# Altium schematic sheet 07_FPGA_banks_1_2_3_4.SchDoc: FPGA banks 1, 2, 3, 4
size A3; Organization: Lime Microsystems; Address1: Surrey Tech Centre; Address2: Guildford GU2 7YG; Address3: Surrey; Address4: United Kingdom; Revision: v1.2; SheetNumber: 7; SheetTotal: 14
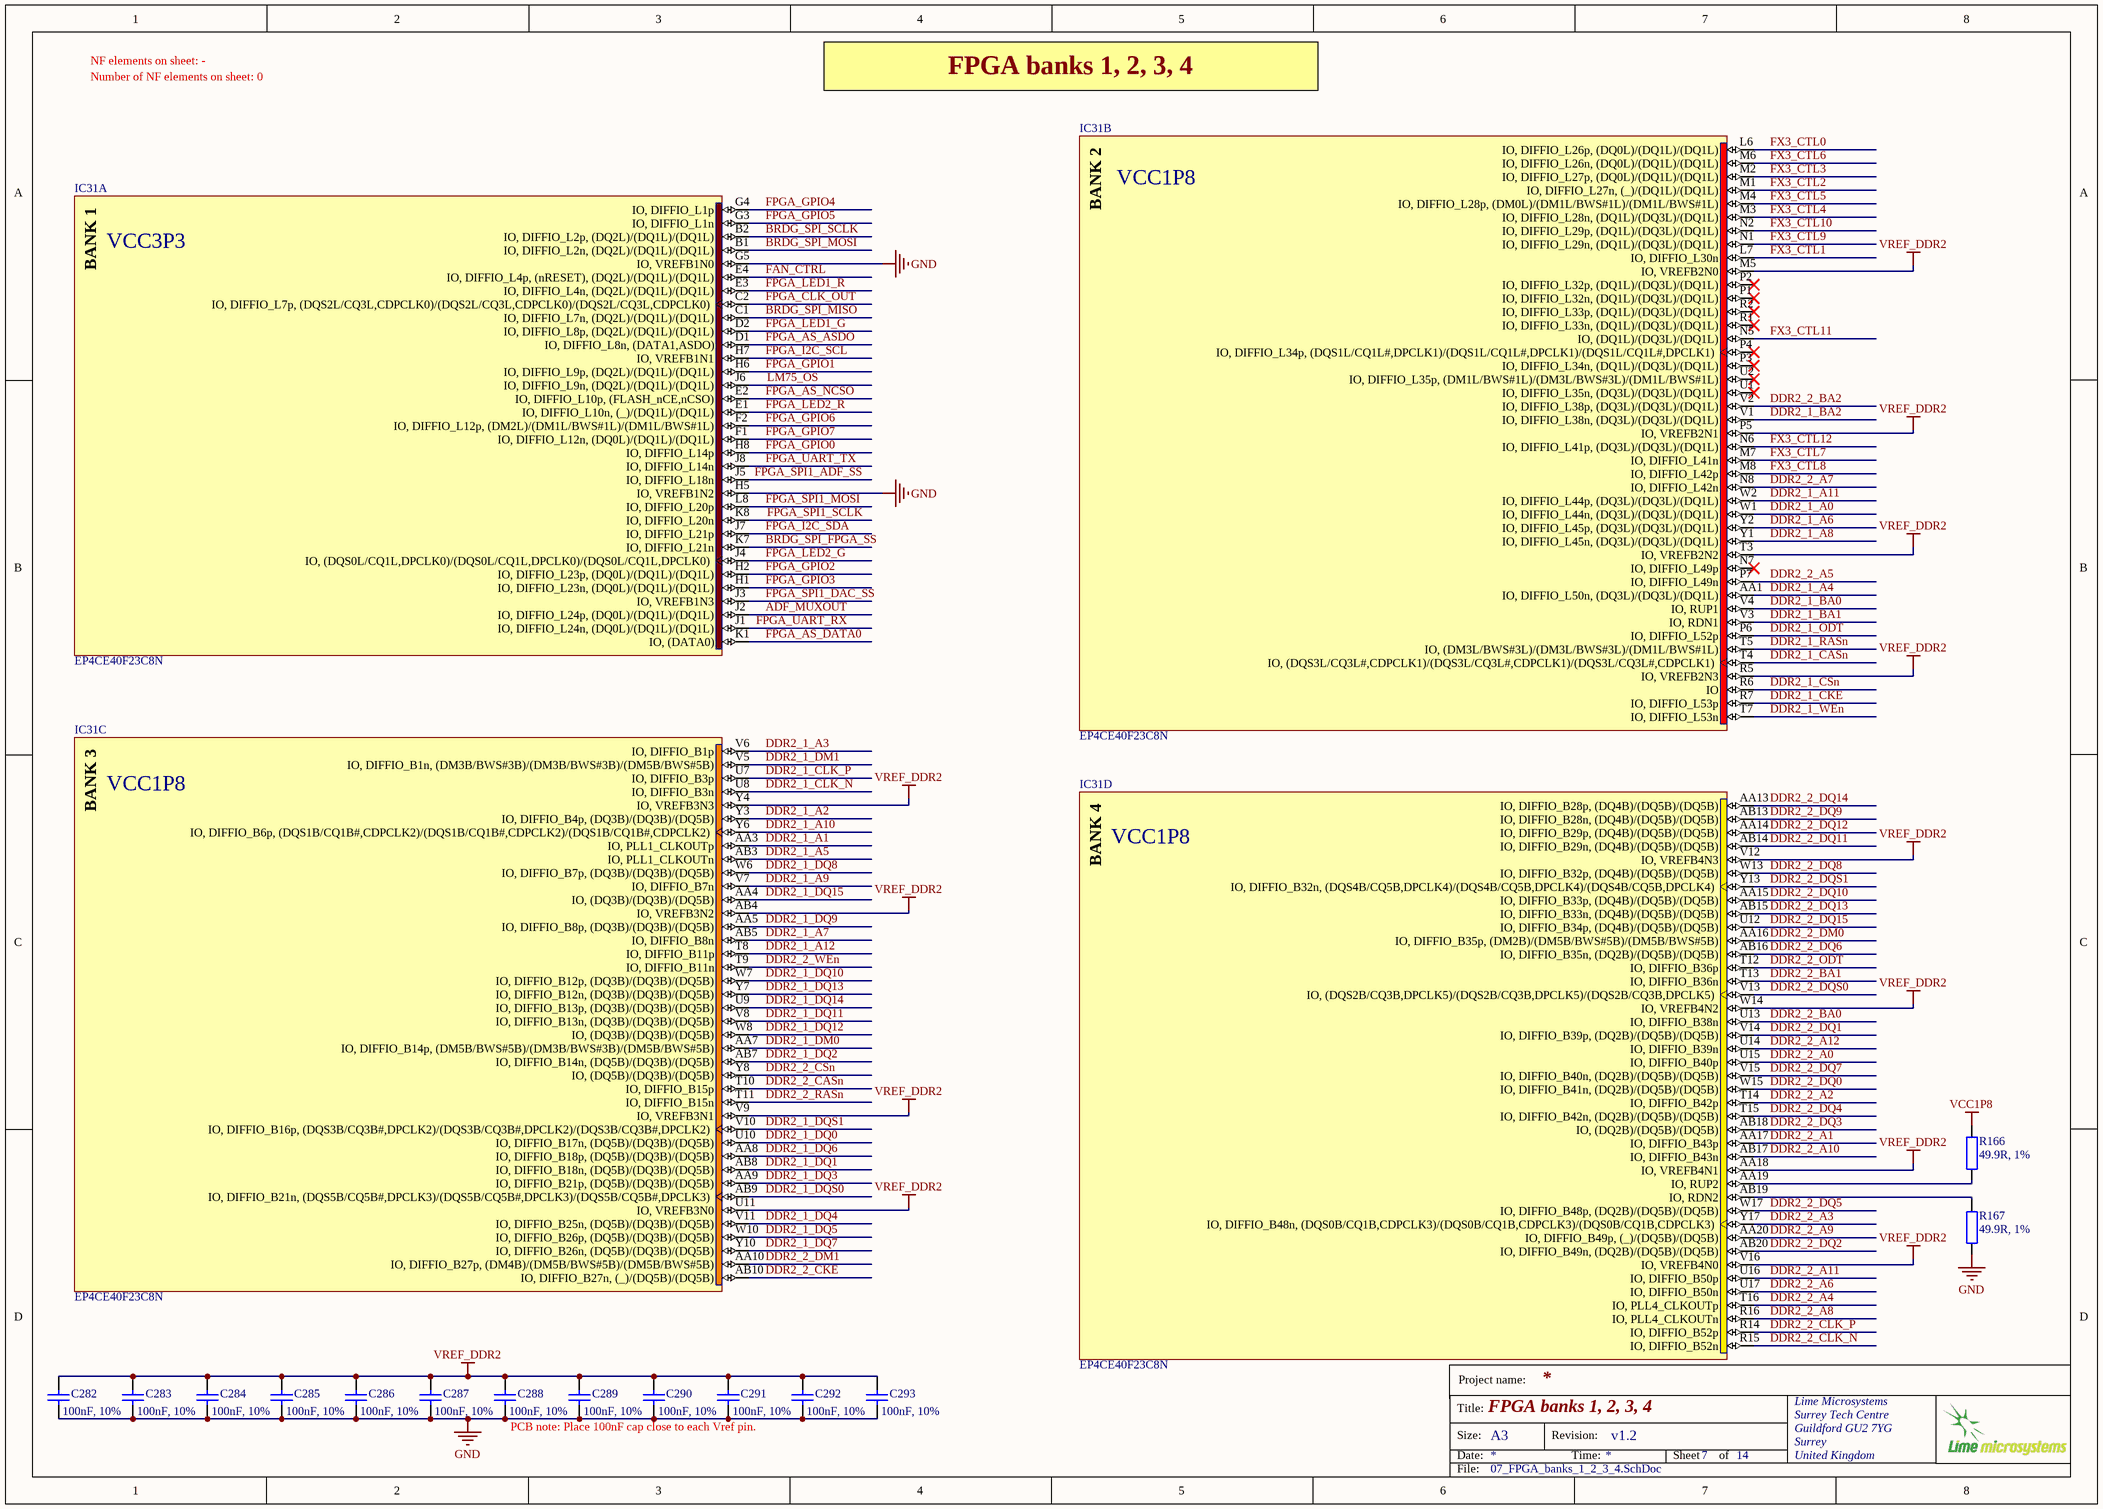
[diagram p0: 07_FPGA_banks_1_2_3_4.SchDoc]

## Parts
C282  100nF, 10%  [CAP0402]
C283  100nF, 10%  [CAP0402]
C284  100nF, 10%  [CAP0402]
C285  100nF, 10%  [CAP0402]
C286  100nF, 10%  [CAP0402]
C287  100nF, 10%  [CAP0402]
C288  100nF, 10%  [CAP0402]
C289  100nF, 10%  [CAP0402]
C290  100nF, 10%  [CAP0402]
C291  100nF, 10%  [CAP0402]
C292  100nF, 10%  [CAP0402]
C293  100nF, 10%  [CAP0402]
IC31  EP4CE40F23C8N  [FBGA484_A-240]  (parts A,B,C,D of 13)
R166  49.9R, 1%  [RES0402]
R167  49.9R, 1%  [RES0402]

## Nets
GND: C282.2 C283.2 C284.2 C285.2 C286.2 C287.2 C288.2 C289.2 C290.2 C291.2 C292.2 C293.2 IC31.G5(IO,_VREFB1N0) IC31.H5(IO,_VREFB1N2) R167.1
VCC1P8: R166.2
VREF_DDR2: C282.1 C283.1 C284.1 C285.1 C286.1 C287.1 C288.1 C289.1 C290.1 C291.1 C292.1 C293.1 IC31.AA18(IO,_VREFB4N1) IC31.AB4(IO,_VREFB3N2) IC31.M5(IO,_VREFB2N0) IC31.P5(IO,_VREFB2N1) IC31.R5(IO,_VREFB2N3) IC31.T3(IO,_VREFB2N2) IC31.U11(IO,_VREFB3N0) IC31.V9(IO,_VREFB3N1) IC31.V12(IO,_VREFB4N3) IC31.V16(IO,_VREFB4N0) IC31.W14(IO,_VREFB4N2) IC31.Y4(IO,_VREFB3N3)
ADF_MUXOUT: IC31.J2(IO,_DIFFIO_L24p,_(DQ0L)/(DQ1L)/(DQ1L))
BRDG_SPI_FPGA_SS: IC31.K7(IO,_DIFFIO_L21n)
BRDG_SPI_MISO: IC31.C1(IO,_DIFFIO_L7n,_(DQ2L)/(DQ1L)/(DQ1L))
BRDG_SPI_MOSI: IC31.B1(IO,_DIFFIO_L2n,_(DQ2L)/(DQ1L)/(DQ1L))
BRDG_SPI_SCLK: IC31.B2(IO,_DIFFIO_L2p,_(DQ2L)/(DQ1L)/(DQ1L))
DDR2_1_A0: IC31.W1(IO,_DIFFIO_L44n,_(DQ3L)/(DQ3L)/(DQ1L))
DDR2_1_A1: IC31.AA3(IO,_PLL1_CLKOUTp)
DDR2_1_A2: IC31.Y3(IO,_DIFFIO_B4p,_(DQ3B)/(DQ3B)/(DQ5B))
DDR2_1_A3: IC31.V6(IO,_DIFFIO_B1p)
DDR2_1_A4: IC31.AA1(IO,_DIFFIO_L50n,_(DQ3L)/(DQ3L)/(DQ1L))
DDR2_1_A5: IC31.AB3(IO,_PLL1_CLKOUTn)
DDR2_1_A6: IC31.Y2(IO,_DIFFIO_L45p,_(DQ3L)/(DQ3L)/(DQ1L))
DDR2_1_A7: IC31.AB5(IO,_DIFFIO_B8n)
DDR2_1_A8: IC31.Y1(IO,_DIFFIO_L45n,_(DQ3L)/(DQ3L)/(DQ1L))
DDR2_1_A9: IC31.V7(IO,_DIFFIO_B7n)
DDR2_1_A10: IC31.Y6(IO,_DIFFIO_B6p,_(DQS1B/CQ1B#,CDPCLK2)/(DQS1B/CQ1B#,CDPCLK2)/(DQS1B/CQ1B#,CDPCLK2))
DDR2_1_A11: IC31.W2(IO,_DIFFIO_L44p,_(DQ3L)/(DQ3L)/(DQ1L))
DDR2_1_A12: IC31.T8(IO,_DIFFIO_B11p)
DDR2_1_BA0: IC31.V4(IO,_RUP1)
DDR2_1_BA1: IC31.V3(IO,_RDN1)
DDR2_1_BA2: IC31.V1(IO,_DIFFIO_L38n,_(DQ3L)/(DQ3L)/(DQ1L))
DDR2_1_CASn: IC31.T4(IO,_(DQS3L/CQ3L#,CDPCLK1)/(DQS3L/CQ3L#,CDPCLK1)/(DQS3L/CQ3L#,CDPCLK1))
DDR2_1_CKE: IC31.R7(IO,_DIFFIO_L53p)
DDR2_1_CLK_N: IC31.U8(IO,_DIFFIO_B3n)
DDR2_1_CLK_P: IC31.U7(IO,_DIFFIO_B3p)
DDR2_1_CSn: IC31.R6(IO)
DDR2_1_DM0: IC31.AA7(IO,_DIFFIO_B14p,_(DM5B/BWS#5B)/(DM3B/BWS#3B)/(DM5B/BWS#5B))
DDR2_1_DM1: IC31.V5(IO,_DIFFIO_B1n,_(DM3B/BWS#3B)/(DM3B/BWS#3B)/(DM5B/BWS#5B))
DDR2_1_DQ0: IC31.U10(IO,_DIFFIO_B17n,_(DQ5B)/(DQ3B)/(DQ5B))
DDR2_1_DQ1: IC31.AB8(IO,_DIFFIO_B18n,_(DQ5B)/(DQ3B)/(DQ5B))
DDR2_1_DQ2: IC31.AB7(IO,_DIFFIO_B14n,_(DQ5B)/(DQ3B)/(DQ5B))
DDR2_1_DQ3: IC31.AA9(IO,_DIFFIO_B21p,_(DQ5B)/(DQ3B)/(DQ5B))
DDR2_1_DQ4: IC31.V11(IO,_DIFFIO_B25n,_(DQ5B)/(DQ3B)/(DQ5B))
DDR2_1_DQ5: IC31.W10(IO,_DIFFIO_B26p,_(DQ5B)/(DQ3B)/(DQ5B))
DDR2_1_DQ6: IC31.AA8(IO,_DIFFIO_B18p,_(DQ5B)/(DQ3B)/(DQ5B))
DDR2_1_DQ7: IC31.Y10(IO,_DIFFIO_B26n,_(DQ5B)/(DQ3B)/(DQ5B))
DDR2_1_DQ8: IC31.W6(IO,_DIFFIO_B7p,_(DQ3B)/(DQ3B)/(DQ5B))
DDR2_1_DQ9: IC31.AA5(IO,_DIFFIO_B8p,_(DQ3B)/(DQ3B)/(DQ5B))
DDR2_1_DQ10: IC31.W7(IO,_DIFFIO_B12p,_(DQ3B)/(DQ3B)/(DQ5B))
DDR2_1_DQ11: IC31.V8(IO,_DIFFIO_B13n,_(DQ3B)/(DQ3B)/(DQ5B))
DDR2_1_DQ12: IC31.W8(IO,_(DQ3B)/(DQ3B)/(DQ5B))
DDR2_1_DQ13: IC31.Y7(IO,_DIFFIO_B12n,_(DQ3B)/(DQ3B)/(DQ5B))
DDR2_1_DQ14: IC31.U9(IO,_DIFFIO_B13p,_(DQ3B)/(DQ3B)/(DQ5B))
DDR2_1_DQ15: IC31.AA4(IO,_(DQ3B)/(DQ3B)/(DQ5B))
DDR2_1_DQS0: IC31.AB9(IO,_DIFFIO_B21n,_(DQS5B/CQ5B#,DPCLK3)/(DQS5B/CQ5B#,DPCLK3)/(DQS5B/CQ5B#,DPCLK3))
DDR2_1_DQS1: IC31.V10(IO,_DIFFIO_B16p,_(DQS3B/CQ3B#,DPCLK2)/(DQS3B/CQ3B#,DPCLK2)/(DQS3B/CQ3B#,DPCLK2))
DDR2_1_ODT: IC31.P6(IO,_DIFFIO_L52p)
DDR2_1_RASn: IC31.T5(IO,_(DM3L/BWS#3L)/(DM3L/BWS#3L)/(DM1L/BWS#1L))
DDR2_1_WEn: IC31.T7(IO,_DIFFIO_L53n)
DDR2_2_A0: IC31.U15(IO,_DIFFIO_B40p)
DDR2_2_A1: IC31.AA17(IO,_DIFFIO_B43p)
DDR2_2_A2: IC31.T14(IO,_DIFFIO_B42p)
DDR2_2_A3: IC31.Y17(IO,_DIFFIO_B48n,_(DQS0B/CQ1B,CDPCLK3)/(DQS0B/CQ1B,CDPCLK3)/(DQS0B/CQ1B,CDPCLK3))
DDR2_2_A4: IC31.T16(IO,_PLL4_CLKOUTp)
DDR2_2_A5: IC31.P7(IO,_DIFFIO_L49n)
DDR2_2_A6: IC31.U17(IO,_DIFFIO_B50n)
DDR2_2_A7: IC31.N8(IO,_DIFFIO_L42n)
DDR2_2_A8: IC31.R16(IO,_PLL4_CLKOUTn)
DDR2_2_A9: IC31.AA20(IO,_DIFFIO_B49p,_(_)/(DQ5B)/(DQ5B))
DDR2_2_A10: IC31.AB17(IO,_DIFFIO_B43n)
DDR2_2_A11: IC31.U16(IO,_DIFFIO_B50p)
DDR2_2_A12: IC31.U14(IO,_DIFFIO_B39n)
DDR2_2_BA0: IC31.U13(IO,_DIFFIO_B38n)
DDR2_2_BA1: IC31.T13(IO,_DIFFIO_B36n)
DDR2_2_BA2: IC31.V2(IO,_DIFFIO_L38p,_(DQ3L)/(DQ3L)/(DQ1L))
DDR2_2_CASn: IC31.T10(IO,_DIFFIO_B15p)
DDR2_2_CKE: IC31.AB10(IO,_DIFFIO_B27n,_(_)/(DQ5B)/(DQ5B))
DDR2_2_CLK_N: IC31.R15(IO,_DIFFIO_B52n)
DDR2_2_CLK_P: IC31.R14(IO,_DIFFIO_B52p)
DDR2_2_CSn: IC31.Y8(IO,_(DQ5B)/(DQ3B)/(DQ5B))
DDR2_2_DM0: IC31.AA16(IO,_DIFFIO_B35p,_(DM2B)/(DM5B/BWS#5B)/(DM5B/BWS#5B))
DDR2_2_DM1: IC31.AA10(IO,_DIFFIO_B27p,_(DM4B)/(DM5B/BWS#5B)/(DM5B/BWS#5B))
DDR2_2_DQ0: IC31.W15(IO,_DIFFIO_B41n,_(DQ2B)/(DQ5B)/(DQ5B))
DDR2_2_DQ1: IC31.V14(IO,_DIFFIO_B39p,_(DQ2B)/(DQ5B)/(DQ5B))
DDR2_2_DQ2: IC31.AB20(IO,_DIFFIO_B49n,_(DQ2B)/(DQ5B)/(DQ5B))
DDR2_2_DQ3: IC31.AB18(IO,_(DQ2B)/(DQ5B)/(DQ5B))
DDR2_2_DQ4: IC31.T15(IO,_DIFFIO_B42n,_(DQ2B)/(DQ5B)/(DQ5B))
DDR2_2_DQ5: IC31.W17(IO,_DIFFIO_B48p,_(DQ2B)/(DQ5B)/(DQ5B))
DDR2_2_DQ6: IC31.AB16(IO,_DIFFIO_B35n,_(DQ2B)/(DQ5B)/(DQ5B))
DDR2_2_DQ7: IC31.V15(IO,_DIFFIO_B40n,_(DQ2B)/(DQ5B)/(DQ5B))
DDR2_2_DQ8: IC31.W13(IO,_DIFFIO_B32p,_(DQ4B)/(DQ5B)/(DQ5B))
DDR2_2_DQ9: IC31.AB13(IO,_DIFFIO_B28n,_(DQ4B)/(DQ5B)/(DQ5B))
DDR2_2_DQ10: IC31.AA15(IO,_DIFFIO_B33p,_(DQ4B)/(DQ5B)/(DQ5B))
DDR2_2_DQ11: IC31.AB14(IO,_DIFFIO_B29n,_(DQ4B)/(DQ5B)/(DQ5B))
DDR2_2_DQ12: IC31.AA14(IO,_DIFFIO_B29p,_(DQ4B)/(DQ5B)/(DQ5B))
DDR2_2_DQ13: IC31.AB15(IO,_DIFFIO_B33n,_(DQ4B)/(DQ5B)/(DQ5B))
DDR2_2_DQ14: IC31.AA13(IO,_DIFFIO_B28p,_(DQ4B)/(DQ5B)/(DQ5B))
DDR2_2_DQ15: IC31.U12(IO,_DIFFIO_B34p,_(DQ4B)/(DQ5B)/(DQ5B))
DDR2_2_DQS0: IC31.V13(IO,_(DQS2B/CQ3B,DPCLK5)/(DQS2B/CQ3B,DPCLK5)/(DQS2B/CQ3B,DPCLK5))
DDR2_2_DQS1: IC31.Y13(IO,_DIFFIO_B32n,_(DQS4B/CQ5B,DPCLK4)/(DQS4B/CQ5B,DPCLK4)/(DQS4B/CQ5B,DPCLK4))
DDR2_2_ODT: IC31.T12(IO,_DIFFIO_B36p)
DDR2_2_RASn: IC31.T11(IO,_DIFFIO_B15n)
DDR2_2_WEn: IC31.T9(IO,_DIFFIO_B11n)
FAN_CTRL: IC31.E4(IO,_DIFFIO_L4p,_(nRESET),_(DQ2L)/(DQ1L)/(DQ1L))
FPGA_AS_ASDO: IC31.D1(IO,_DIFFIO_L8n,_(DATA1,ASDO))
FPGA_AS_DATA0: IC31.K1(IO,_(DATA0))
FPGA_AS_NCSO: IC31.E2(IO,_DIFFIO_L10p,_(FLASH_nCE,nCSO))
FPGA_CLK_OUT: IC31.C2(IO,_DIFFIO_L7p,_(DQS2L/CQ3L,CDPCLK0)/(DQS2L/CQ3L,CDPCLK0)/(DQS2L/CQ3L,CDPCLK0))
FPGA_GPIO0: IC31.H8(IO,_DIFFIO_L14p)
FPGA_GPIO1: IC31.H6(IO,_DIFFIO_L9p,_(DQ2L)/(DQ1L)/(DQ1L))
FPGA_GPIO2: IC31.H2(IO,_DIFFIO_L23p,_(DQ0L)/(DQ1L)/(DQ1L))
FPGA_GPIO3: IC31.H1(IO,_DIFFIO_L23n,_(DQ0L)/(DQ1L)/(DQ1L))
FPGA_GPIO4: IC31.G4(IO,_DIFFIO_L1p)
FPGA_GPIO5: IC31.G3(IO,_DIFFIO_L1n)
FPGA_GPIO6: IC31.F2(IO,_DIFFIO_L12p,_(DM2L)/(DM1L/BWS#1L)/(DM1L/BWS#1L))
FPGA_GPIO7: IC31.F1(IO,_DIFFIO_L12n,_(DQ0L)/(DQ1L)/(DQ1L))
FPGA_I2C_SCL: IC31.H7(IO,_VREFB1N1)
FPGA_I2C_SDA: IC31.J7(IO,_DIFFIO_L21p)
FPGA_LED1_G: IC31.D2(IO,_DIFFIO_L8p,_(DQ2L)/(DQ1L)/(DQ1L))
FPGA_LED1_R: IC31.E3(IO,_DIFFIO_L4n,_(DQ2L)/(DQ1L)/(DQ1L))
FPGA_LED2_G: IC31.J4(IO,_(DQS0L/CQ1L,DPCLK0)/(DQS0L/CQ1L,DPCLK0)/(DQS0L/CQ1L,DPCLK0))
FPGA_LED2_R: IC31.E1(IO,_DIFFIO_L10n,_(_)/(DQ1L)/(DQ1L))
FPGA_SPI1_ADF_SS: IC31.J5(IO,_DIFFIO_L18n)
FPGA_SPI1_DAC_SS: IC31.J3(IO,_VREFB1N3)
FPGA_SPI1_MOSI: IC31.L8(IO,_DIFFIO_L20p)
FPGA_SPI1_SCLK: IC31.K8(IO,_DIFFIO_L20n)
FPGA_UART_RX: IC31.J1(IO,_DIFFIO_L24n,_(DQ0L)/(DQ1L)/(DQ1L))
FPGA_UART_TX: IC31.J8(IO,_DIFFIO_L14n)
FX3_CTL0: IC31.L6(IO,_DIFFIO_L26p,_(DQ0L)/(DQ1L)/(DQ1L))
FX3_CTL1: IC31.L7(IO,_DIFFIO_L30n)
FX3_CTL2: IC31.M1(IO,_DIFFIO_L27n,_(_)/(DQ1L)/(DQ1L))
FX3_CTL3: IC31.M2(IO,_DIFFIO_L27p,_(DQ0L)/(DQ1L)/(DQ1L))
FX3_CTL4: IC31.M3(IO,_DIFFIO_L28n,_(DQ1L)/(DQ3L)/(DQ1L))
FX3_CTL5: IC31.M4(IO,_DIFFIO_L28p,_(DM0L)/(DM1L/BWS#1L)/(DM1L/BWS#1L))
FX3_CTL6: IC31.M6(IO,_DIFFIO_L26n,_(DQ0L)/(DQ1L)/(DQ1L))
FX3_CTL7: IC31.M7(IO,_DIFFIO_L41n)
FX3_CTL8: IC31.M8(IO,_DIFFIO_L42p)
FX3_CTL9: IC31.N1(IO,_DIFFIO_L29n,_(DQ1L)/(DQ3L)/(DQ1L))
FX3_CTL10: IC31.N2(IO,_DIFFIO_L29p,_(DQ1L)/(DQ3L)/(DQ1L))
FX3_CTL11: IC31.N5(IO,_(DQ1L)/(DQ3L)/(DQ1L))
FX3_CTL12: IC31.N6(IO,_DIFFIO_L41p,_(DQ3L)/(DQ3L)/(DQ1L))
LM75_OS: IC31.J6(IO,_DIFFIO_L9n,_(DQ2L)/(DQ1L)/(DQ1L))
NetIC31_AA19: IC31.AA19(IO,_RUP2) R166.1
NetIC31_AB19: IC31.AB19(IO,_RDN2) R167.2

Not connected (* = marked no-connect by the designer): IC31 N7(IO,_DIFFIO_L49p)* P1(IO,_DIFFIO_L32n,_(DQ1L)/(DQ3L)/(DQ1L))* P2(IO,_DIFFIO_L32p,_(DQ1L)/(DQ3L)/(DQ1L))* P3(IO,_DIFFIO_L34n,_(DQ1L)/(DQ3L)/(DQ1L))* P4(IO,_DIFFIO_L34p,_(DQS1L/CQ1L#,DPCLK1)/(DQS1L/CQ1L#,DPCLK1)/(DQS1L/CQ1L#,DPCLK1))* R1(IO,_DIFFIO_L33n,_(DQ1L)/(DQ3L)/(DQ1L))* R2(IO,_DIFFIO_L33p,_(DQ1L)/(DQ3L)/(DQ1L))* U1(IO,_DIFFIO_L35n,_(DQ3L)/(DQ3L)/(DQ1L))* U2(IO,_DIFFIO_L35p,_(DM1L/BWS#1L)/(DM3L/BWS#3L)/(DM1L/BWS#1L))*

## Notes on the sheet
- NF elements on sheet: -
- Number of NF elements on sheet: 0
- FPGA banks 1, 2, 3, 4
- VCC3P3
- VCC1P8
- PCB note: Place 100nF cap close to each Vref pin.
- Project name:
- Title:
- Size:
- Date:
- A3
- Revision:
- Time:
- Sheet
- of
- File:
- (in symbol EP4CE40F23C7N, part A) BANK 1
- (in symbol EP4CE40F23C7N, part B) BANK 2
- (in symbol EP4CE40F23C7N, part C) BANK 3
- (in symbol EP4CE40F23C7N, part D) BANK 4

## Library data of the parts
C282-C293 = Cap_0603: Manufacturer Part Number 1: GRM155R71C104KA88D; Part Description: 0.10µF ±10% 16V X7R Ceramic Capacitor -55°C ~ 125°C Surface Mount, MLCC 0402 (1005 Metric) 0.039" L x 0.020" W (1.00mm x 0.50mm); Brand: Murata Electronics; Type: General Purpose MLCC; Capacitance: 0.1 uF; Temperature Coefficient / Code: +/- 15 %; Voltage Rating DC: 16 V; Supplier 1: Mouser; Supplier Part Number 1: 81-GRM155R71C104KA88; Tolerance: 10 %; Case Code - in: 0402; Manufacturer: Murata Electronics; Category: Multilayer Ceramic Capacitors MLCC - SMD/SMT; Value: 100nF, 10%; Manufacturer Part Number: GRM155R71C104KA88D
IC31 = EP4CE40F23C7N: IC FPGA 328 I/O 484FBGA; Manufacturer: Altera; Number of I/O: 328; Number of LABs/CLBs: 2475; Number of Logic Elements/Cells: 39600; Total RAM Bits: 1161216; Voltage - Supply: 1.15 V ~ 1.25 V; DatasheetVersion: ver1.6, Nov-2011; PackageDescription: 484-Pin FineLine Ball Grid Array (FBGA) - Wire Bond - A:2.40; Code_JEDEC: MS-034-AAJ-1; ComponentLink1Description: Manufacturer URL; ComponentLink1URL: http://www.altera.com/; ComponentLink2Description: Handbook; ComponentLink2URL: http://www.altera.com/literature/hb/cyclone-iv/cyclone4-handbook.pdf; ComponentLink3Description: Pinout; ComponentLink3URL: http://www.altera.com/literature/lit-dp.jsp?category=cyc%204&showspreadsheet=y; ComponentLink4Description: Package Specification; ComponentLink4URL: http://www.altera.com/devicepackaging/04R00247-02.pdf; Category: Integrated Circuits (ICs); Manufacturer Part Number 1: EP4CE40F23C8N; Mounting Type: Surface Mount; Number of Gates: -; Operating Temperature: 0°C ~ 85°C; Package / Case: 484-BGA; RoHS: RoHS Compliant; Supplier 1: Digi-Key; Supplier Device Package: 484-FBGA (23x23); Supplier Part Number 1: 544-2811-ND; Part Description: IC FPGA 328 I/O 484FBGA
R166 R167 = Res_0402: Manufacturer: Samsung Electro-Mechanics America, Inc.; Manufacturer Part Number: RC1005F49R9CS; Part Description: RES SMD 49.9 OHM 1% 1/16W 0402; Temperature Coefficient: ±100ppm/°C; Resistance (Ohms): 49.9; Power (Watts): 0.063W, 1/16W; Number of Terminations: 2; Size / Dimension: 0.039" L x 0.020" W (1.00mm x 0.50mm); Supplier Device Package: 0402 (1005 Metric); RoHS: RoHS Compliant; Supplier Part Number 1: 1276-3469-6-ND; Features: -; Packaging: Digi-Reel®; Tolerance: ±1%; Height: 0.016" (0.40mm); Category: Resistors; Composition: Thick Film; Package / Case: 0402 (1005 Metric); Supplier 1: Digi-Key; Operating Temperature: -55°C ~ 155°C; Value: 49.9R, 1%